# Altium schematic sheet RF-Frontend.SchDoc: CATS Telemetry
size A4; Author: Luca Jost; Revision: 1.0; SheetNumber: 1; SheetTotal: 1; Subtitle: RF Frontend
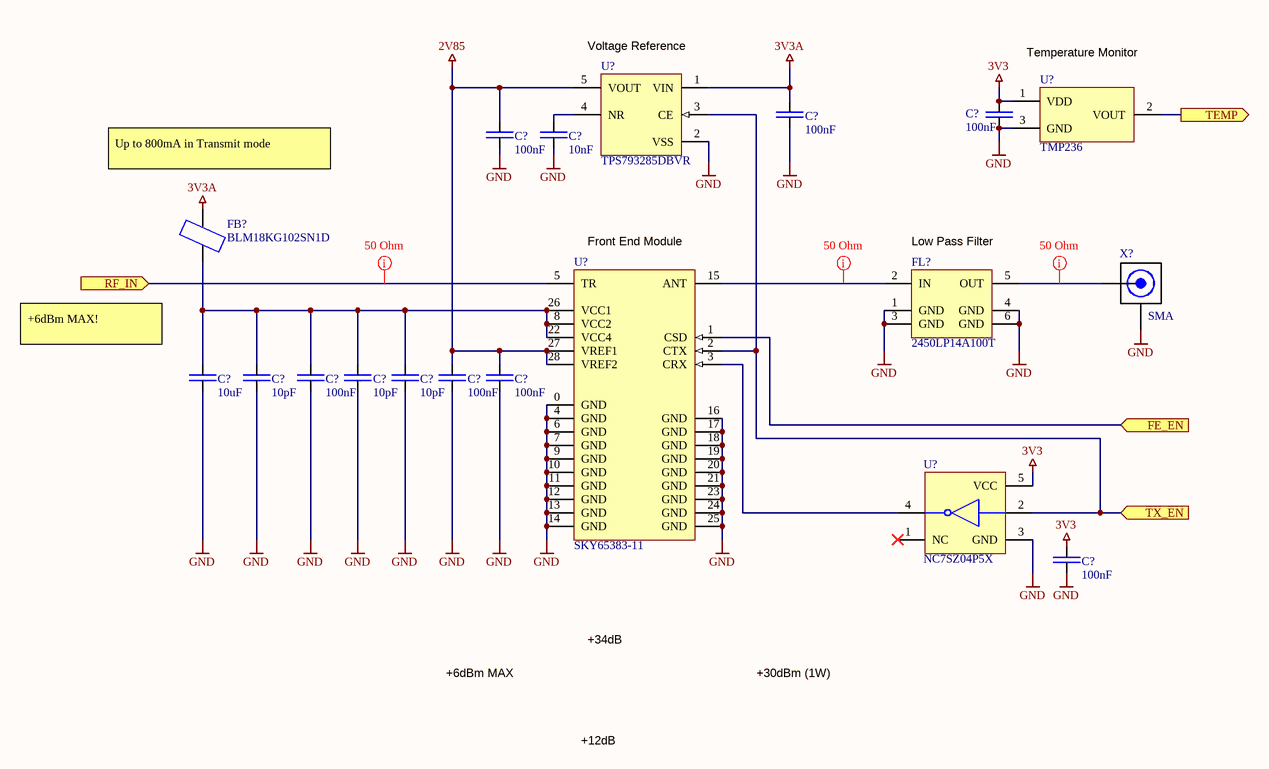
[diagram p0: RF-Frontend.SchDoc]

## Parts
(Parts that share a designator on the sheet are numbered #1, #2 ... from top to bottom, then left to right.)
C?#1  100nF  [SMD Keramikkondensator 0805]
C?#2  100nF  [SMD Keramikkondensator 0805]
C?#3  100nF  [SMD Keramikkondensator 0805]
C?#4  10nF  [SMD Keramikkondensator 0805]
C?#5  10uF  [SMD Keramikkondensator 0805]
C?#6  10pF  [SMD Keramikkondensator 0805]
C?#7  100nF  [SMD Keramikkondensator 0805]
C?#8  10pF  [SMD Keramikkondensator 0805]
C?#9  10pF  [SMD Keramikkondensator 0805]
C?#10  100nF  [SMD Keramikkondensator 0805]
C?#11  100nF  [SMD Keramikkondensator 0805]
C?#12  100nF  [SMD Keramikkondensator 0805]
FB?  BLM18KG102SN1D  [SMD Ferrite Bead 0603]
FL?  2450LP14A100T  [SMD Filter 2450LP14A100T]
U?#1  TPS793285DBVR  [SMD IC SOT-23-5]
U?#2  TMP236  [SMD IC SOT-23]
U?#3  SKY65383-11  [SMD IC 28-MCM]
U?#4  NC7SZ04P5X  [SMD IC SOT-353 (SC-70-5)]
X?  SMA  [THT Buchse SMA Female]

## Ports
FE_EN (in), RF_IN (in), TEMP (out), TX_EN (in)

## Nets
2V85: C?#3.2 C?#10.2 C?#11.2 U?#1.5(VOUT) U?#3.27(VREF1) U?#3.28(VREF2)
3V3: C?#2.2 C?#12.2 U?#2.1(VDD) U?#4.5(VCC)
3V3A: C?#1.2 FB?.2 U?#1.1(VIN)
GND: C?#1.1 C?#2.1 C?#3.1 C?#4.1 C?#5.1 C?#6.1 C?#7.1 C?#8.1 C?#9.1 C?#10.1 C?#11.1 C?#12.1 FL?.1(GND) FL?.3(GND) FL?.4(GND) FL?.6(GND) U?#1.2(VSS) U?#2.3(GND) U?#3.0(GND) U?#3.4(GND) U?#3.6(GND) U?#3.7(GND) U?#3.9(GND) U?#3.10(GND) U?#3.11(GND) U?#3.12(GND) U?#3.13(GND) U?#3.14(GND) U?#3.16(GND) U?#3.17(GND) U?#3.18(GND) U?#3.19(GND) U?#3.20(GND) U?#3.21(GND) U?#3.23(GND) U?#3.24(GND) U?#3.25(GND) U?#4.3(GND) X?.2(RF)
FE_EN: U?#3.1(CSD) ; port FE_EN
RF_IN: U?#3.5(TR) ; port RF_IN
TEMP: U?#2.2(VOUT) ; port TEMP
TX_EN: U?#1.3(CE) U?#3.2(CTX) U?#4.2(A) ; port TX_EN
NetC?#4_2: C?#4.2 U?#1.4(NR)
NetC?#5_2: C?#5.2 C?#6.2 C?#7.2 C?#8.2 C?#9.2 FB?.1 U?#3.8(VCC2) U?#3.22(VCC4) U?#3.26(VCC1)
NetFL?_2: FL?.2(IN) U?#3.15(ANT)
NetFL?_5: FL?.5(OUT) X?.1(RF)
NetU?#3_3: U?#3.3(CRX) U?#4.4(Y)

Not connected (* = marked no-connect by the designer): U?#4 1(NC)*

## Layout directives
rule Impedance Constraint [Min = 50.00    Max = 50.00    ]: NetFL?_2, NetFL?_5, RF_IN

## Notes on the sheet
- (near U?#1) Voltage Reference
- Temperature Monitor
- Up to 800mA in Transmit mode
- (near U?#3) Front End Module
- (near FL?) Low Pass Filter
- +6dBm MAX!
- +6dBm MAX
- +34dB
- +30dBm (1W)
- +12dB
- Title
- Author:
- Subtitle
- Date:
- Rev:
- CATS
- Sheet
- of
- File:

## Library data of the parts
C?#1-C?#3 C?#7 C?#10-C?#12 = E6 - 100nF: SMD Ceramic Capacitor E6; Unit Price: 0.01; Number: -; Supplier: -
C?#4 = E6 - 10nF: SMD Ceramic Capacitor E6; Unit Price: 0.01; Number: -; Supplier: -
C?#5 = E6 - 10uF: SMD Ceramic Capacitor E6; Unit Price: 0.01; Number: -; Supplier: -
C?#6 C?#8 C?#9 = E6 - 10pF: SMD Ceramic Capacitor E6; Unit Price: 0.01; Number: -; Supplier: -
FB? = BLM18KG102SN1D: 1 kOhms @ 100MHz 1 Power Line Ferrite Bead 0603 (1608 Metric) 1A 200mOhm; ComponentLink1Description: Datasheet; ComponentLink1URL: https://www.murata.com/en-us/products/productdata/8796738650142/ENFA0003.pdf; Digikey: 490-17349-1-ND
FL? = 2450LP14A100T: 2.45GHz Center Frequency Low Pass RF Filter (Radio Frequency) 100MHz Bandwidth 0.5dB 0603 (1608 Metric), 6 PC Pad; ComponentLink1Description: Datasheet; ComponentLink1URL: https://www.johansontechnology.com/datasheets/2450LP14A100/2450LP14A100.pdf; Digikey: 712-1129-2-ND
U?#1 = TPS793285DBVR: Linear Voltage Regulator IC Positive Fixed 1 Output  200mA SOT-23-5 2.85V; ComponentLink1Description: Datasheet; ComponentLink1URL: https://media.digikey.com/pdf/Data%20Sheets/Texas%20Instruments%20PDFs/TPS793_Rev2015.pdf; Digikey: 296-12157-1-ND
U?#2 = TMP236: Low-Power, High-Accuracy Analog Output Temperature Sensors; ComponentLink1Description: Datasheet; ComponentLink1URL: https://www.ti.com/lit/ds/symlink/tmp236.pdf?HQS=dis-dk-null-digikeymode-dsf-pf-null-wwe&ts=1624574807670&ref_url=https%253A%252F%252Fwww.digikey.ch%252F; Digikey: 296-TMP236A4DBZRCT-ND
U?#3 = SKY65383-11: 2400 to 2483 MHz Transmit/Receive / Front-End Module +30dBm; ComponentLink1Description: Datasheet; ComponentLink1URL: https://www.skyworksinc.com/-/media/SkyWorks/Documents/Products/2901-3000/SKY65383-11_202668G.pdf; Digikey: 863-1798-1-ND
U?#4 = NC7SZ04P5X: Inverter IC 1 Channel  SC-70-5; ComponentLink1Description: Datasheet; ComponentLink1URL: https://rocelec.widen.net/view/pdf/vg5irfcitj/ONSM-S-A0003590433-1.pdf?t.download=true&u=5oefqw
X? = SMA Connector: Female SMA Connector THT; Digikey: 931-1361-ND